# Altium schematic sheet CodecB.SchDoc
size A4; SheetNumber: 11; SheetTotal: 14
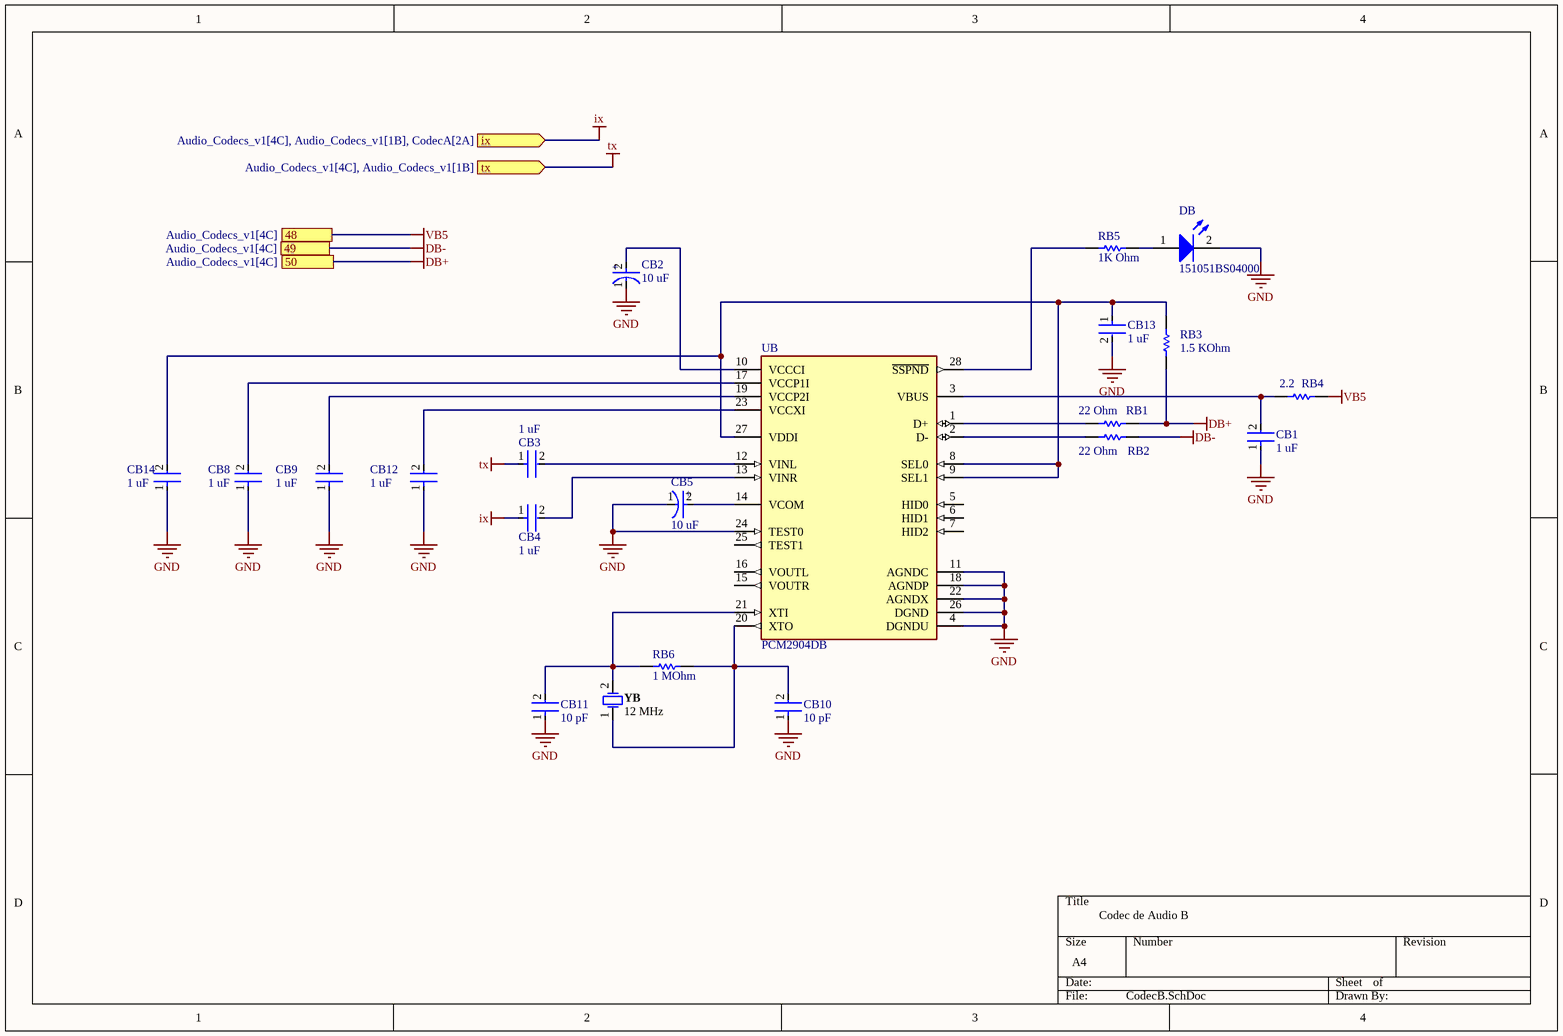
[diagram p0: CodecB.SchDoc]

## Parts
CB1  1 uF  [FP-CC0805-0_85-MFG]
CB2  10 uF  [FP-RAD-TH-D_6_3_0_5-L_7_1-MFG]
CB3  1 uF  [FP-CC0805-0_85-MFG]
CB4  1 uF  [FP-CC0805-0_85-MFG]
CB5  10 uF  [FP-RAD-TH-D_6_3_0_5-L_7_1-MFG]
CB8  1 uF  [FP-CC0805-0_85-MFG]
CB9  1 uF  [FP-CC0805-0_85-MFG]
CB10  10 pF  [FP-CC0805-0_85-MFG]
CB11  10 pF  [FP-CC0805-0_85-MFG]
CB12  1 uF  [FP-CC0805-0_85-MFG]
CB13  1 uF  [FP-CC0805-0_85-MFG]
CB14  1 uF  [FP-CC0805-0_85-MFG]
DB  151051BS04000  [WL-TMRC_D5.9H8.7]
RB1  22 Ohm  [RESC2013X60X40ML20T25]
RB2  22 Ohm  [RESC2013X60X40ML20T25]
RB3  1.5 KOhm  [RESC2013X60X40ML20T25]
RB4  2.2  [RESC2013X60X40ML20T25]
RB5  1K Ohm  [RESC2013X60X40ML20T25]
RB6  1 MOhm  [RESC2013X60X40ML20T25]
UB  PCM2904DB  [FP-DB0028A-IPC_A]
YB  12 MHz  [FOX-FOXSLF160-20]

## Ports
48 (see Audio_Codecs_v1[4C]), 49 (see Audio_Codecs_v1[4C]), 50 (see Audio_Codecs_v1[4C]), ix (in, see Audio_Codecs_v1[4C], Audio_Codecs_v1[1B], CodecA[2A]), tx (in, see Audio_Codecs_v1[4C], Audio_Codecs_v1[1B])

## Nets
DB+: RB1.1 RB3.2 ; port 50
DB-: RB2.2 ; port 49
GND: CB1.1 CB2.1(C) CB5.1(C) CB8.1 CB9.1 CB10.1 CB11.1 CB12.1 CB13.2 CB14.1 DB.2(K) UB.4(DGNDU) UB.11(AGNDC) UB.18(AGNDP) UB.22(AGNDX) UB.24(TEST0) UB.26(DGND)
ix: CB4.1 ; port ix
tx: CB3.1 ; port tx
VB5: RB4.1 ; port 48
NetCB1_2: CB1.2 RB4.2 UB.3(VBUS)
NetCB2_2: CB2.2(A) UB.10(VCCCI)
NetCB3_2: CB3.2 UB.12(VINL)
NetCB4_2: CB4.2 UB.13(VINR)
NetCB5_2: CB5.2(A) UB.14(VCOM)
NetCB8_2: CB8.2 UB.17(VCCP1I)
NetCB9_2: CB9.2 UB.19(VCCP2I)
NetCB10_2: CB10.2 RB6.2 UB.20(XTO) YB.1
NetCB11_2: CB11.2 RB6.1 UB.21(XTI) YB.2
NetCB12_2: CB12.2 UB.23(VCCXI)
NetCB13_1: CB13.1 CB14.2 RB3.1 UB.8(SEL0) UB.9(SEL1) UB.27(VDDI)
NetDB_1: DB.1(A) RB5.1
NetRB1_2: RB1.2 UB.1(D+)
NetRB2_1: RB2.1 UB.2(D-)
NetRB5_2: RB5.2 UB.28(~{SSPND})

Not connected (* = marked no-connect by the designer): UB 5(HID0) 6(HID1) 7(HID2) 15(VOUTR) 16(VOUTL) 25(TEST1)

## Notes on the sheet
- Codec de Audio B
- (in symbol CMP-05427-001316-1) +

## Library data of the parts
CB1 CB3 CB4 CB8-CB14 = CMP-2100-03606-3: CAP CER 0.1UF 50V X7R 0805; Manufacturer Part Number: CC0805KRX7R9BB104; Manufacturer: Yageo; Tolerance: 0.1; Capacitance: 100 nF; Value: 100 nF; Device Class L1: Passive Components; ComponentLink2Description: Datasheet; Package: CC0805-0.85; Digikey Description: CAP CER 0.1UF 50V X7R 0805; Device Class L3: Ceramic Capacitors; Temperature: -30°C to +85°C; Temperature Characteristic: X7R; Voltage Rating: 50 V; Height: 0.95mm; RoHS: TRUE; Ipc Land Pattern Name: CAPC200125X85; Device Class L2: Capacitors; Category: Cap; Temperature Range Low: -30°C; Temperature Range High: +85°C; Material: Ceramic; Mouser Description: Multilayer Ceramic Capacitors MLCC - SMD/SMT 100nF 50V X7R 10%; Footprint Url: http://www.yageo.com/exep/pages/download/literatures/UPY-C_GEN_24.pdf; Automotive: No; Octopart: https://octopart.com/cc0805krx7r9bb104-yageo-192993; Lead Free: Yes; ComponentLink2URL: http://www.yageo.com/documents/recent/UPY-GPHC_Y5V_6.3V-to-50V_8.pdf
CB2 CB5 = CMP-05427-001316-1: Aluminum Electrolytic Capacitors (Radial Lead Type) 100uF ±20% 16V; Life (Hours): 1000Hour; Lead Diameter: 0.45mm; Polarity: Polar; Ripple Current: 91mA; Series: KA; Packaging: Tape and Reel; Voltage Rating: 16V; Voltage Rating (DC): 16V; Min Operating Temperature: -40°C; Lead Pitch: 2.5mm; Mount: Through Hole; Height - Seated (Max): 0.315inch; Package Quantity: 2000; Length: 7mm; Termination: Radial; Voltage: 16V; Diameter: 6.3mm; Height: 7mm; Radiation Hardening: No; RoHS Compliant: Yes; Tolerance: 20%; Capacitance: 100uF; Case/Package: Radial; Max Operating Temperature: 85°C
DB = CMP-1488-00009-2: NexarPartId: 29717812; Test Current: 20mA; Forward Voltage: 3.2V; Wavelength: 470nm; Lens Size: 5mm; Lens Style: Circular, Diffused, Round; Forward Current: 100mA; Peak Wavelength: 465nm; Viewing Angle: 40°; Luminous Intensity: 500mcd; Max Reverse Voltage (DC): 5V; Case/Package: Radial; Width: 5mm; Mount: Through Hole; Min Operating Temperature: -40°C; Length: 5mm; Height: 8.6mm; Max Operating Temperature: 85°C; Packaging: Bulk; Color: Blue; RoHS: Compliant; REACH SVHC: Unknown; Dominant Wavelength: 470nm
RB1-RB6 = CMP-2001-00580-1: Manufacturer: Panasonic; Part Number: ERA6AEB101V
UB = CMP-04873-000006-1: IC STEREO AUD CODEC W/USB 28SSOP; Max Supply Voltage: 5.25V; Number of Analog Outputs: 2; Operating Supply Voltage: 5V; Number of A/D Converters: 1; Min Supply Voltage: 3.25V; Resolution: 16b; Nominal Supply Current: 67mA; Number of Bits: 16; Sampling Rate: 48KS/s; Signal to Noise Ratio (SNR): 89dB; Interface: USB; Width: 5.3mm; Length: 10.2mm; Radiation Hardening: No; Weight: 0.010081oz; Height: 1.95mm; Mount: Surface Mount; Number of Analog Inputs: 2; RoHS Compliant: Yes; Lead Free: Lead Free; Number of DAC Channels: 2; Max Operating Temperature: 85°C; Number of Channels: 2; Number of Pins: 28; Packaging: Rail/Tube; Case/Package: SSOP; Number of ADC Channels: 2; Number of D/A Converters: 1; Min Operating Temperature: -25°C; Package Quantity: 47; Type: General Purpose
YB = CMP-1749-00003-1: Resistance Weld Thru-Hole Crystal, 16 MHz, -20 to 70 degC, 2-Pin THD, RoHS, Bulk; Voltage Rating: 250 V; Tolerance: 1%; Resistance: 221 kohm; Case\Package: Axial; Power Rating: 250 mW; RoHSCompliant: true; Package Quantity: 200; Packaging: Bulk; Min Operating Temperature: -55 degC; DatasheetVersion: Mar-15; ComponentLink1URL: http://www.foxonline.com/; Max Operating Temperature: 155 degC; PackageReference: FOXSLF160-20; Mount: Through Hole; PackageDescription: 2-Pin Through Hole Device, Body 11.35 x 4.65 mm; ComponentLink1Description: Manufacturer URL; ComponentLink2URL: http://www.foxonline.com/pdfs/hc49slf.pdf; ComponentLink2Description: Datasheet; Length: 0.248 inch